# EAGLE design eagle2_hotovo (EAGLE 8.7.1)
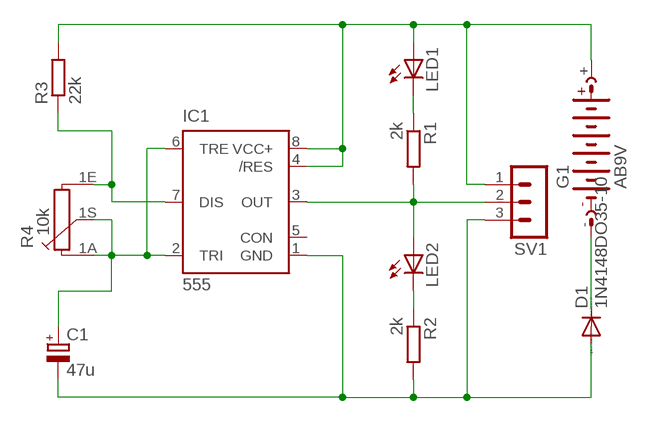
[diagram p0: schematic, sheet 1]

## Parts
C1  47u  CPOL-EUE3.5-8  [E3,5-8]
D1  1N4148DO35-10  [DO35-10]
G1  AB9V  [AB9V]
IC1  555  555P  [DIP08]
LED1  LED3MM  [LED3MM]
LED2  LED3MM  [LED3MM]
R1  2k  R-EU_0207/10  [0207/10]
R2  2k  R-EU_0207/10  [0207/10]
R3  22k  R-EU_0207/10  [0207/10]
R4  10k  PC16S  [PC16S]
SV1  MA03-1  [MA03-1]

## Nets
N$1: IC1.3(OUT) LED2.A R1.2 SV1.2
N$2: LED1.K(C) R1.1
N$3: LED2.K(C) R2.1
N$4: C1.- D1.A IC1.1(GND) R2.2 SV1.3
N$5: D1.C G1.-
N$6: G1.+ IC1.4(/RES) IC1.8(VCC+) LED1.A R3.2 SV1.1
N$7: IC1.7(DIS) R3.1 R4.1E
N$9: C1.+ IC1.2(TRI) IC1.6(TRE) R4.1A R4.1S
Unconnected: IC1.5(CON)

## Library data of the parts
C1 = rcl:CPOL-EU: POLARIZED CAPACITOR, European symbol; SPICEPREFIX: C
D1 = diode:1N4148: DIODE high speed (Philips)
G1 = battery:AB9V: 9-V BATTERY CLIP
IC1 = SparkFun-IC-Special-Function:555: General purpose bipolar Timer Datasheet <http://www.sparkfun.com/datasheets/Components/General/ne555.pdf> SparkFun Products SparkFun SparkPunk Sequencer Kit <https://www.sparkfun.com/products/12707> (KIT-12707) Storefront Component: 555 Timer <https://www.sparkfun.com/products/9273> (COM-09273) Two parts valid for production: VFP: IC-11930 (M7555 PTH) VFP: IC-09173 (555 PTH) - Preferred; PROD_ID: IC-09173; PROD_ID_ALT: IC-09173
LED1 LED2 = led:LED: LED OSRAM: - CHIPLED LG R971, LG N971, LY N971, LG Q971, LY Q971, LO R971, LY R971 LH N974, LH R974 LS Q976, LO Q976, LY Q976 LO Q996 - Hyper CHIPLED LW Q18S LB Q993, LB Q99A, LB R99A - SideLED LS A670, LO A670, LY A670, LG A670, LP A670 LB A673, LV A673, LT A673, LW A673 LH A674 LY A675 LS A676, LA A676, LO A676, LY A676, LW A676 LS A679, LY A679, LG A679 - Hyper Micro SIDELED® LS Y876, LA Y876, LO Y876, LY Y876 LT Y87S - SmartLED LW L88C, LW L88S LB L89C, LB L89S, LG L890 LS L89K, LO L89K, LY L89K LS L896, LA L896, LO L896, LY L896 - TOPLED LS T670, LO T670, LY T670, LG T670, LP T670 LSG T670, LSP T670, LSY T670, LOP T670, LYG T670 LG T671, LOG T671, LSG T671 LB T673, LV T673, LT T673, LW T673 LH T674 LS T676, LA T676, LO T676, LY T676, LB T676, LH T676, LSB T676, LW T676 LB T67C, LV T67C, LT T67C, LS T67K, LO T67K, LY T67K, LW E67C LS E67B, LA E67B, LO E67B, LY E67B, LB E67C, LV E67C, LT E67C LW T67C LS T679, LY T679, LG T679 LS T770, LO T770, LY T770, LG T770, LP T770 LB T773, LV T773, LT T773, LW T773 LH T774 LS E675, LA E675, LY E675, LS T675 LS T776, LA T776, LO T776, LY T776, LB T776 LHGB T686 LT T68C, LB T68C - Hyper Mini TOPLED® LB M676 - Mini TOPLED Santana® LG M470 LS M47K, LO M47K, LY M47K Source: http://www.osram.convergy.de LUXEON: - LUMILED® LXK2-PW12-R00, LXK2-PW12-S00, LXK2-PW14-U00, LXK2-PW14-V00 LXK2-PM12-R00, LXK2-PM12-S00, LXK2-PM14-U00 LXK2-PE12-Q00, LXK2-PE12-R00, LXK2-PE12-S00, LXK2-PE14-T00, LXK2-PE14-U00 LXK2-PB12-K00, LXK2-PB12-L00, LXK2-PB12-M00, LXK2-PB14-N00, LXK2-PB14-P00, LXK2-PB14-Q00 LXK2-PR12-L00, LXK2-PR12-M00, LXK2-PR14-Q00, LXK2-PR14-R00 LXK2-PD12-Q00, LXK2-PD12-R00, LXK2-PD12-S00 LXK2-PH12-R00, LXK2-PH12-S00 LXK2-PL12-P00, LXK2-PL12-Q00, LXK2-PL12-R00 Source: www.luxeon.com KINGBRIGHT: KA-3528ASYC Source: www.kingbright.com
R1-R3 = rcl:R-EU_: RESISTOR, European symbol; SPICEPREFIX: R
R4 = piher:PC16S: POTENTIOMETER single carbon potentiometer, 16 mm, S3ROH; OC_FARNELL: 4452940; OC_NEWARK: unknown
SV1 = con-lstb:MA03-1: PIN HEADER; OC_FARNELL: unknown; OC_NEWARK: unknown

## Board
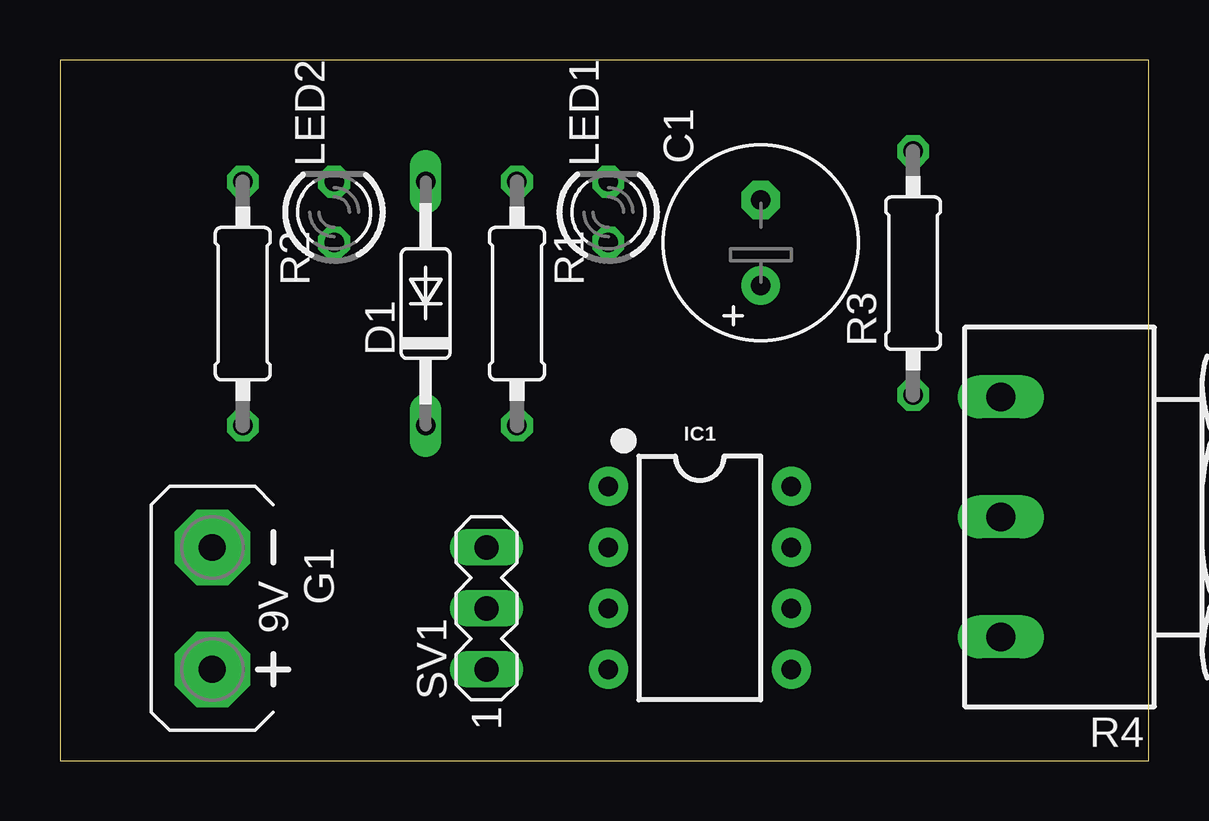
[diagram p1: board, top side]
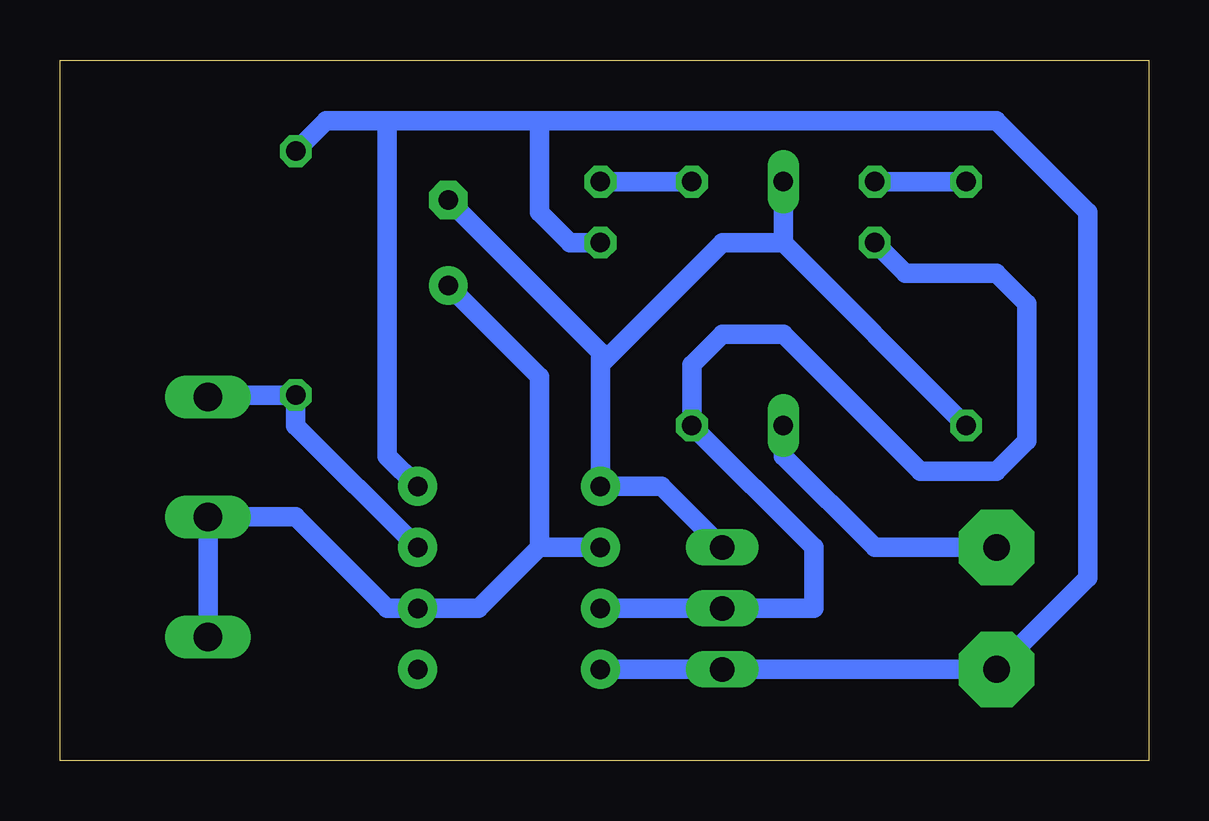
[diagram p2: board, bottom side, seen from below]

Size 45.39 x 29.2 mm. Coordinates in mm from the lower left corner, seen from the top.
Outline: 0,0 45.39,0 45.39,29.2 0,29.2 0,0
Copper layers (1*16): Top 0.035mm / dielectric 1.5mm / Bottom 0.035mm
Design rules "default": minimum track width 6mil, minimum drill 0.35mm, track to track 6mil, track to pad 6mil, pad to pad 6mil, via to via 6mil, smd to smd 6mil, copper to edge 40mil, drill to drill 6mil, minimum pad ring 10mil, minimum via ring 8mil, stop-mask expansion 4mil, vias tented up to drill 0mil, thermal gap 10mil

### Footprints (pad centres in the part's own frame; a part is rotated, then mirrored left to right if it is on the bottom)
E3,5-8 = drill 0.813 pad 1.6: + -1.778,0 | drill 0.813 pad 1.6 octagon: - 1.778,0
DO35-10 = drill 0.813 long: A 5.08,0; C -5.08,0
AB9V = drill 1.118 pad 3.15 octagon: + 0,2.54; - 0,-2.54
DIP08 = drill 0.813 pad 1.626: 1 -3.81,-3.81; 2 -1.27,-3.81; 3 1.27,-3.81; 4 3.81,-3.81; 5 3.81,3.81; 6 1.27,3.81; 7 -1.27,3.81; 8 -3.81,3.81
LED3MM = drill 0.813 octagon: A -1.27,0; K 1.27,0
0207/10 = drill 0.813 octagon: 1 -5.08,0; 2 5.08,0
PC16S = drill 1.2 long: 1A -5,6.5; 1E 5,6.5; 1S 0,6.5
MA03-1 = drill 1.016 long: 1 -2.54,0; 2 0,0; 3 2.54,0

### Placement (x,y rotation side)
C1  29.21,21.59 90 top
D1  15.24,19.05 90 top
G1  6.35,6.35 180 top
IC1  26.67,7.62 270 top
LED1  22.86,22.86 90 top
LED2  11.43,22.86 90 top
R1  19.05,19.05 270 top
R2  7.62,19.05 270 top
R3  35.56,20.32 90 top
R4  45.72,10.16 90 top
SV1  17.78,6.35 90 top

### Tracks (layer width: path | path; a pad name or v marks a point on that pad's centre or on a via)
N$1
  Bottom 0.813: LED2.A 10.16,20.32 6.35,20.32 5.08,19.05 5.08,13.34 6.35,12.06 9.52,12.06 15.24,17.78 17.78,17.78 19.05,16.51 R1.2 13.97,8.89 13.97,6.35 SV1.2 IC1.3
N$2
  Bottom 0.813: R1.1 LED1.K
N$3
  Bottom 0.813: R2.1 LED2.K
N$4
  Bottom 0.813: R2.2 15.24,21.59 | 15.24,21.59 D1.A | SV1.3 20.32,11.43 IC1.1 22.86,16.51 | C1.- 22.86,17.02 22.86,16.51 | 22.86,16.51 17.78,21.59 15.24,21.59
N$5
  Bottom 0.813: D1.C 15.24,12.7 11.43,8.89 G1.-
N$6
  Bottom 0.813: IC1.8 31.75,12.7 31.75,26.67 | 25.4,26.67 6.35,26.67 2.54,22.86 2.54,7.62 G1.+ SV1.1 IC1.4 | LED1.A 24.13,21.59 25.4,22.86 25.4,26.67 | R3.2 34.29,26.67 31.75,26.67 | 31.75,26.67 25.4,26.67
N$7
  Bottom 0.813: R4.1E 39.14,15.24 R3.1 35.56,13.97 IC1.7
N$9
  Bottom 0.813: IC1.2 25.4,8.89 | 25.4,8.89 27.94,6.35 IC1.6 31.75,6.35 35.56,10.16 R4.1S R4.1A | 25.4,8.89 25.4,16 C1.+